# Altium schematic sheet ADC-Peripherals.SchDoc: <SPECIFIC SHEET FUNCTION>
size A3; Date: DO NOT USE, RATHER USE PROJ OPTIONS; DrawnBy: DO NOT USE, RATHER USE PROJ OPTIONS; Engineer: DO NOT USE, RATHER USE PROJ OPTIONS; Organization: DO NOT USE, RATHER USE PROJ OPTIONS; DocumentNumber: 5; Revision: DO NOT USE, RATHER USE PROJ OPTIONS; SheetNumber: 8; SheetTotal: 12; SCH_Sheet_Filename: ADC-Peripherals.SchDoc; CurrentTime: DO NOT USE, RATHER USE PROJ OPTIONS; Time: DO NOT USE, RATHER USE PROJ OPTIONS; DocumentFullPathAndName: DO NOT USE, RATHER USE PROJ OPTIONS; DocumentName: DO NOT USE, RATHER USE PROJ OPTIONS; ModifiedDate: DO NOT USE, RATHER USE PROJ OPTIONS; ImagePath: DO NOT USE, RATHER USE PROJ OPTIONS
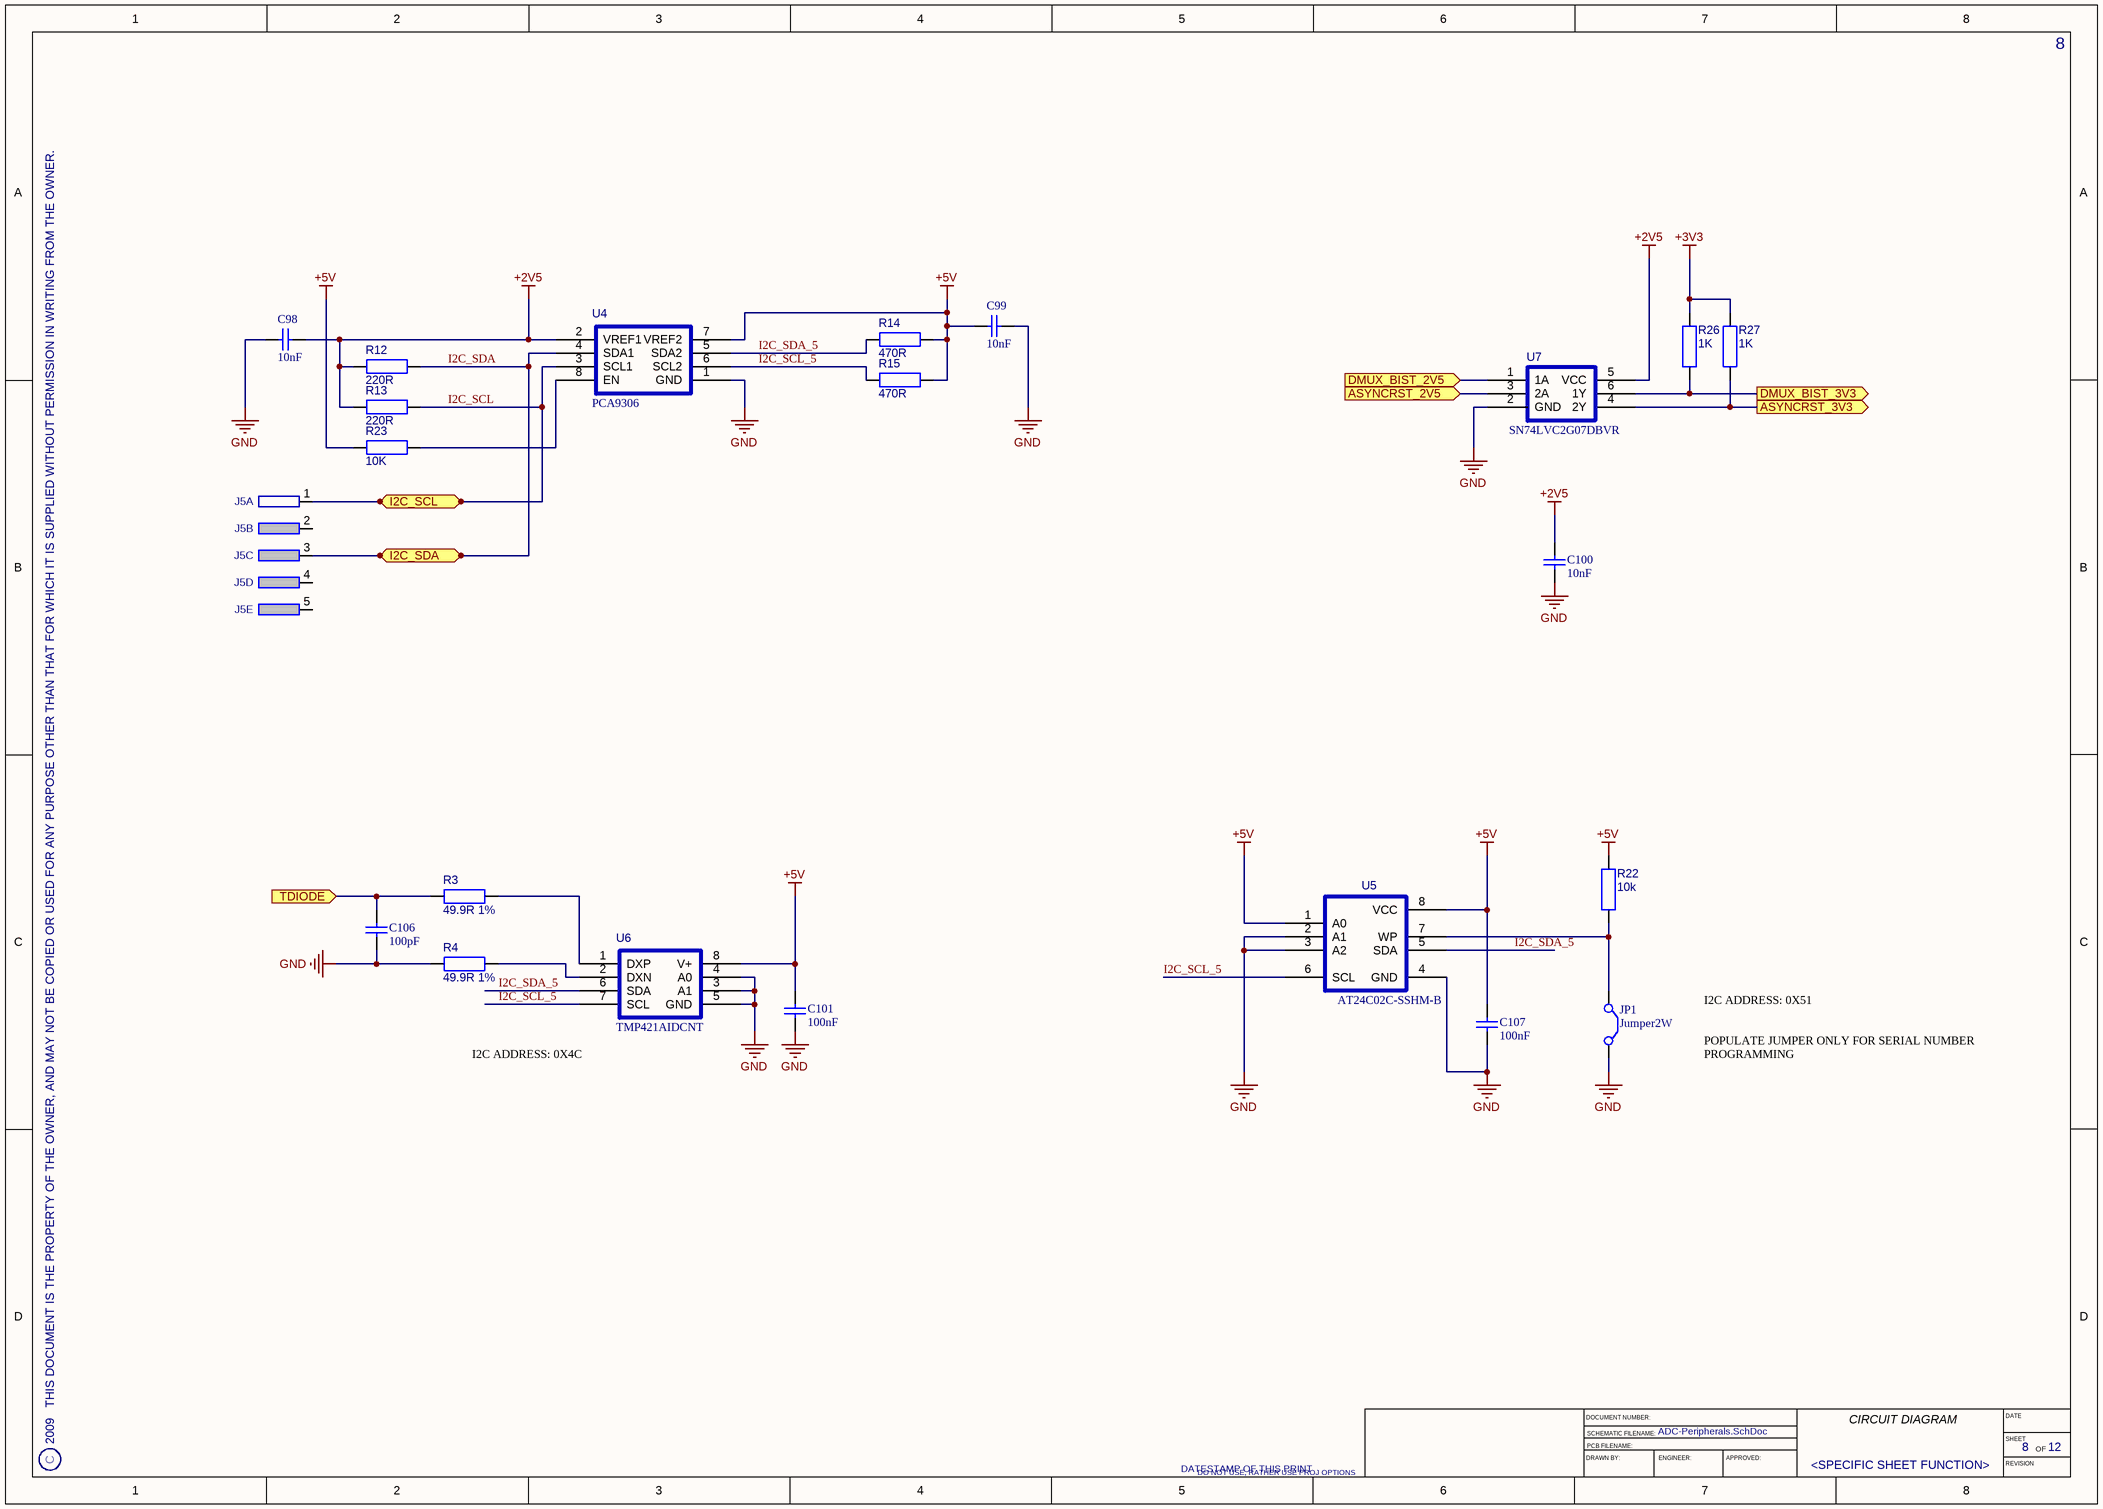
[diagram p0: ADC-Peripherals.SchDoc]

## Parts
C98  value 10nF  [CAPC1005X55N]  (hidden comment: Capacitor 0402 SMD)
C99  value 10nF  [CAPC1005X55N]  (hidden comment: Capacitor 0402 SMD)
C100  value 10nF  [CAPC1005X55N]  (hidden comment: Capacitor 0402 SMD)
C101  value 100nF  [CAPC1005X55N]  (hidden comment: Capacitor 0402 SMD)
C106  value 100pF  [CAPC1005X55N]  (hidden comment: Capacitor 0402 SMD)
C107  value 100nF  [CAPC1005X55N]  (hidden comment: Capacitor 0402 SMD)
J5  SAMTEC-TSM-105-01-TM-SV-5W-HDR  [TSM_5X1_SV]  (value not drawn)  (parts A,B,C,D,E of 5)
JP1  Jumper2W  [JP-100MIL]
R3  49.9R 1%  [0603]
R4  49.9R 1%  [0603]
R12  220R  [0603]
R13  220R  [0603]
R14  470R  [0603]
R15  470R  [0603]
R22  10k  [0603]
R23  10K  [0603]
R26  1K  [0603]
R27  1K  [0603]
U4  PCA9306  [SOP65P400X130-8USR]
U5  AT24C02C-SSHM-B  [SOIC127P600X175-8N]
U6  TMP421AIDCNT  [TI_SOT23-8]
U7  SN74LVC2G07DBVR  [SOT95P280X145-6N]

## Ports
ASYNCRST_2V5 (in), ASYNCRST_3V3 (out), DMUX_BIST_2V5 (in), DMUX_BIST_3V3 (out), I2C_SCL (bidir), I2C_SDA (bidir), TDIODE (in)

## Nets
+2V5: C98.2 C100.2 R12.1 R13.1 U4.2(VREF1) U7.5(VCC)
+3V3: R26.1 R27.1
+5V: C99.1 C101.2 C107.2 R14.2 R15.2 R22.1 R23.2 U4.7(VREF2) U5.1(A0) U5.8(VCC) U6.8(V+)
GND: C98.1 C99.2 C100.1 C101.1 C106.1 C107.1 JP1.2(C2) R4.1 U4.1(GND) U5.2(A1) U5.3(A2) U5.4(GND) U6.3(A1) U6.4(A0) U6.5(GND) U7.2(GND)
ASYNCRST_2V5: U7.3(2A) ; port ASYNCRST_2V5
ASYNCRST_3V3: R27.2 U7.4(2Y) ; port ASYNCRST_3V3
DMUX_BIST_2V5: U7.1(1A) ; port DMUX_BIST_2V5
DMUX_BIST_3V3: R26.2 U7.6(1Y) ; port DMUX_BIST_3V3
I2C_SCL: J5.1 R13.2 U4.3(SCL1) ; port I2C_SCL
I2C_SCL_5: R15.1 U4.6(SCL2) U5.6(SCL) U6.7(SCL)
I2C_SDA: J5.3 R12.2 U4.4(SDA1) ; port I2C_SDA
I2C_SDA_5: R14.1 U4.5(SDA2) U5.5(SDA) U6.6(SDA)
TDIODE: C106.2 R3.1 ; port TDIODE
NetJP1_1: JP1.1(C1) R22.2 U5.7(WP)
NetR3_2: R3.2 U6.1(DXP)
NetR4_2: R4.2 U6.2(DXN)
NetR23_1: R23.1 U4.8(EN)

Not connected (* = marked no-connect by the designer): J5 2 4 5

## Notes on the sheet
- I2C ADDRESS: 0X51
- (near U6) I2C ADDRESS: 0X4C
- POPULATE JUMPER ONLY FOR SERIAL NUMBER PROGRAMMING
- 2009   THIS DOCUMENT IS THE PROPERTY OF THE OWNER, AND MAY NOT BE COPIED OR USED FOR ANY PURPOSE OTHER THAN THAT FOR WHICH IT IS SUPPLIED WITHOUT PERMISSION IN WRITING FROM THE OWNER.
- C
- DATESTAMP OF THIS PRINT
- DRAWN BY:
- DOCUMENT NUMBER:
- SCHEMATIC FILENAME:
- PCB FILENAME:
- ENGINEER:
- APPROVED:
- CIRCUIT DIAGRAM
- DATE
- SHEET
- REVISION
- OF

## Library data of the parts
C98-C101 C106 C107 = cap0402: Created_By: EDA-ASA; Checked_By: *; Checked_Date: *; HelpURL: *; Supplier1: *; Supplier2: *; Unit_Cost: *; MOQ: *; Leadtime: *; Inventory_Stock: *; Tolerance: *; Wattage: *; Package: 0402; ComponentLinked1Description: *; ComponentLinked1URL: *; ComponentLinked2Description: *; ComponentLinked2URL: *; ComponentLinked3Description: *; ComponentLinked3URL: *; ComponentLinked4Description: *; ComponentLinked4URL: *
JP1 = Jumper2W: Jumper Wire; Published: 24-Mar-1999; LatestRevisionDate: 17-Jul-2002; LatestRevisionNote: Re-released for DXP Platform.; PackageReference: RAD-0.2; Publisher: Altium Limited
R3 R4 R12-R15 R22 R23 R26 R27 = RES-0805: RESISTOR SMD 0603; Checked_By: NN; Manufacturer: *; Manufacturer_PN: *; Created_By: *; Checked_Date: 5-08-2009; HelpURL: *; ComponentLink1Description: Footprint Detail; ComponentLink1URL: *; ComponentLink2Description: Application Note; ComponentLink2URL: *; ComponentLink3Description: Layout Guidelines; ComponentLink3URL: *; ComponentLink4Description: Technology Reference; ComponentLink4URL: *; Supplier1: *; Supplier2: *; Unit_Cost: *; MOQ: *; Leadtime: *; Inventory_Stock: *; Tolerance: *; Wattage: *; Voltage: *; Package: 0603; ComponentLink5Description: Production Detail; ComponentLink5URL: *; Note: *; Stock Code: *
  R3 R4: Value: 49.9R 1%
  R12 R13: Value: 220R
  R14 R15: Value: 470R
  R22: Value: 10k
  R23: Value: 10K
  R26 R27: Value: 1K
U4 = PCA9306DCTR: Dual Bidirectional I2C Bus and SMBus Voltage-Level Translator; Manufacturer: TI; Created_By: IN; Manufacturer_PN: PCA9306; Checked_By: *; Checked_Date: *; HelpURL: X:\Datasheets\By_Manufacturer\TI\pca9306.pdf; ComponentLink1Description: Footprint Detail; ComponentLink1URL: *; ComponentLink2Description: Application Note; ComponentLink2URL: *; ComponentLink3Description: Layout Guidelines; ComponentLink3URL: *; ComponentLink4Description: Technology Reference; ComponentLink4URL: *; Supplier1: *; Supplier2: *; Unit_Cost: *; MOQ: *; Leadtime: *; Inventory_Stock: *; Tolerance: *; Wattage: *; Voltage: *; Package: *; ComponentLink5Description: Production Detail; ComponentLink5URL: *; Note: *; Stock Code: *
U5 = AT24C02B: Two wire Serial EEPROM 2K (256 x 8); Manufacturer: Atmel; Created_By: IN; Manufacturer_PN: AT24C02C-SSHM-B; Checked_By: *; Checked_Date: *; HelpURL: X:\Datasheets\By_Manufacturer\ATMEL\at24c02b.pdf; ComponentLink1Description: Footprint Detail; ComponentLink1URL: *; ComponentLink2Description: Application Note; ComponentLink2URL: *; ComponentLink3Description: Layout Guidelines; ComponentLink3URL: *; ComponentLink4Description: Technology Reference; ComponentLink4URL: *; Supplier1: *; Supplier2: *; Unit_Cost: *; MOQ: *; Leadtime: *; Inventory_Stock: *; Tolerance: *; Wattage: *; Voltage: *; Package: *; ComponentLink5Description: Production Detail; ComponentLink5URL: *; Note: *; Stock Code: *
U6 = TMP421AIDCNT: Remote and Local TempreatureSensor in SOT23-8; Manufacturer: TI; Manufacturer_PN: TMP421AIDCNT; Created_By: IN; Checked_By: *; Checked_Date: *; HelpURL: X:Datasheets\By_Manufacturer\TI\tmp421.pdf; ComponentLink1Description: Footprint Detail; ComponentLink1URL: X:Datasheets\By_Manufacturer\TI\tmp421.pdf; ComponentLink2Description: Application Note; ComponentLink2URL: *; ComponentLink3Description: Layout Guidelines; ComponentLink3URL: *; ComponentLink4Description: Technology Reference; ComponentLink4URL: *; Supplier1: *; Supplier2: *; Unit_Cost: *; MOQ: *; Leadtime: *; Inventory_Stock: *; Tolerance: *; Wattage: *; Voltage: *; Package: *; ComponentLink5Description: Production Detail; ComponentLink5URL: *; Note: *; Stock Code: *
U7 = SN74LVC2G07DBVR: Dual Buffer/Driver with open-drain output; Manufacturer: TI; Created_By: IN; Manufacturer_PN: SN74LVC2G07DBVR; Checked_By: *; Checked_Date: *; HelpURL: X:\Datasheets\By_Manufacturer\TI\sn74lvc2g07.pdf; ComponentLink1Description: Footprint Detail; ComponentLink2Description: Application Note; ComponentLink2URL: *; ComponentLink3Description: Layout Guidelines; ComponentLink3URL: *; ComponentLink4Description: Technology Reference; ComponentLink4URL: *; Supplier1: *; Supplier2: *; Unit_Cost: *; MOQ: *; Leadtime: *; Inventory_Stock: *; Tolerance: *; Wattage: *; Voltage: *; Package: *; ComponentLink5Description: Production Detail; ComponentLink5URL: *; Note: *; Stock Code: *
J5 = SAMTEC-TSM-105-01-TM-SV-5W-HDR: Value: SAMTEC-TSM-105-01-TM-SV-5W-HDR